# Altium schematic sheet Aux_Outputs.SchDoc: RP2040 CNC
size B; Author: AM; CompanyName: Expatria Technologies; DrawnBy: A.Marles; Engineer: AM; Organization: Expatria Technolgoies; DocumentNumber: 10; SheetNumber: 10; SheetTotal: 14
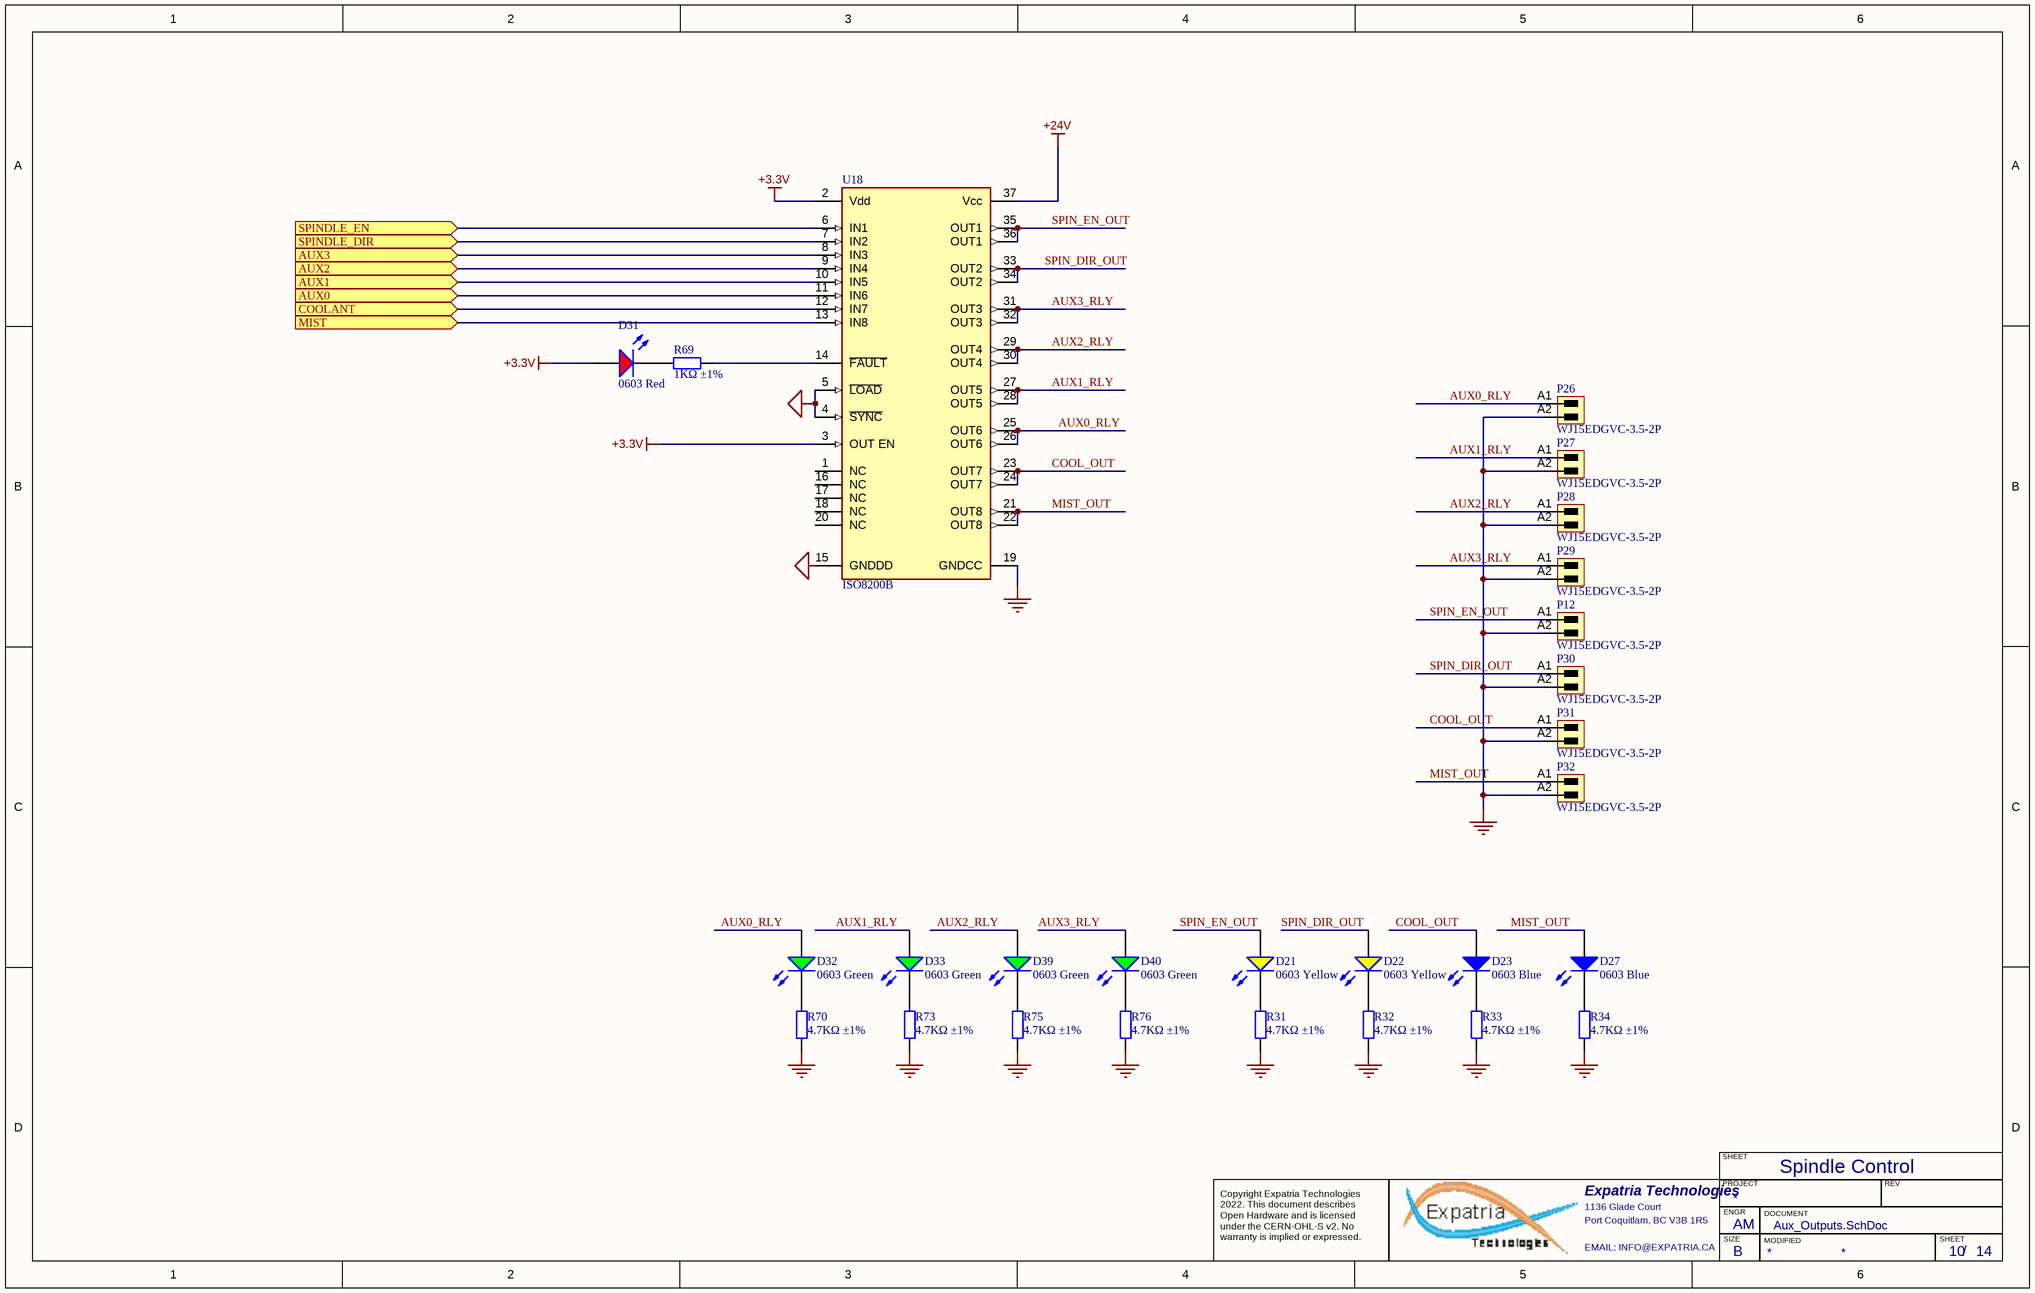
[diagram p0: Aux_Outputs.SchDoc]

## Parts
D21  0603 Yellow  [0603_LED_S1]
D22  0603 Yellow  [0603_LED_S1]
D23  0603 Blue  [0603_LED_S1]
D27  0603 Blue  [0603_LED_S1]
D31  0603 Red  [0603_LED_S1]
D32  0603 Green  [0603_LED_S1]
D33  0603 Green  [0603_LED_S1]
D39  0603 Green  [0603_LED_S1]
D40  0603 Green  [0603_LED_S1]
P12  WJ15EDGVC-3.5-2P  [691321100002]
P26  WJ15EDGVC-3.5-2P  [691321100002]
P27  WJ15EDGVC-3.5-2P  [691321100002]
P28  WJ15EDGVC-3.5-2P  [691321100002]
P29  WJ15EDGVC-3.5-2P  [691321100002]
P30  WJ15EDGVC-3.5-2P  [691321100002]
P31  WJ15EDGVC-3.5-2P  [691321100002]
P32  WJ15EDGVC-3.5-2P  [691321100002]
R31  4.7KΩ ±1%  [0402_R]
R32  4.7KΩ ±1%  [0402_R]
R33  4.7KΩ ±1%  [0402_R]
R34  4.7KΩ ±1%  [0402_R]
R69  1KΩ ±1%  [0402_R]
R70  4.7KΩ ±1%  [0402_R]
R73  4.7KΩ ±1%  [0402_R]
R75  4.7KΩ ±1%  [0402_R]
R76  4.7KΩ ±1%  [0402_R]
U18  ISO8200B  [FP-PowerSO-36-MFG]

## Ports
AUX0 (in), AUX1 (in), AUX2 (in), AUX3 (in), COOLANT (in), MIST (in), SPINDLE_DIR (in), SPINDLE_EN (in)

## Nets
+3.3V: D31.A U18.2(Vdd) U18.3(OUT_EN)
+24V: U18.37(Vcc)
GND: P12.A2 P26.A2 P27.A2 P28.A2 P29.A2 P30.A2 P31.A2 P32.A2 R31.1 R32.1 R33.1 R34.1 R70.1 R73.1 R75.1 R76.1 U18.19(GNDCC)
MCU_GND: U18.4(~{SYNC}) U18.5(~{LOAD}) U18.15(GNDDD)
AUX0: U18.11(IN6) ; port AUX0
AUX0_RLY: D32.A P26.A1 U18.25(OUT6) U18.26(OUT6)
AUX1: U18.10(IN5) ; port AUX1
AUX1_RLY: D33.A P27.A1 U18.27(OUT5) U18.28(OUT5)
AUX2: U18.9(IN4) ; port AUX2
AUX2_RLY: D39.A P28.A1 U18.29(OUT4) U18.30(OUT4)
AUX3: U18.8(IN3) ; port AUX3
AUX3_RLY: D40.A P29.A1 U18.31(OUT3) U18.32(OUT3)
COOL_OUT: D23.A P31.A1 U18.23(OUT7) U18.24(OUT7)
COOLANT: U18.12(IN7) ; port COOLANT
MIST: U18.13(IN8) ; port MIST
MIST_OUT: D27.A P32.A1 U18.21(OUT8) U18.22(OUT8)
SPIN_DIR_OUT: D22.A P30.A1 U18.33(OUT2) U18.34(OUT2)
SPIN_EN_OUT: D21.A P12.A1 U18.35(OUT1) U18.36(OUT1)
SPINDLE_DIR: U18.7(IN2) ; port SPINDLE_DIR
SPINDLE_EN: U18.6(IN1) ; port SPINDLE_EN
NetD21_K: D21.K R31.2
NetD22_K: D22.K R32.2
NetD23_K: D23.K R33.2
NetD27_K: D27.K R34.2
NetD31_K: D31.K R69.1
NetD32_K: D32.K R70.2
NetD33_K: D33.K R73.2
NetD39_K: D39.K R75.2
NetD40_K: D40.K R76.2
NetR69_2: R69.2 U18.14(~{FAULT})

Not connected (* = marked no-connect by the designer): U18 1(NC) 16(NC) 17(NC) 18(NC) 20(NC)

## Notes on the sheet
- Spindle Control
- SHEET
- Expatria Technologies
- 1136 Glade Court
- Port Coquitlam, BC V3B 1R5
- PROJECT
- SIZE
- ENGR
- MODIFIED
- DOCUMENT
- REV
- Copyright Expatria Technologies 2022. This document describes Open Hardware and is licensed under the CERN-OHL-S v2. No warranty is implied or expressed.
- EMAIL: INFO@EXPATRIA.CA
- B
- /

## Library data of the parts
D21 D22 = 0603 LED Yellow: LED; ComponentLink1Description: 供应商链接; ComponentLink1URL: http://www.szlcsc.com/product/details_73147.html; Package: 0603; Supplier: LC; SuppliersPartNumber: C72038; Color: Yellow
D23 D27 = 0603 LED Blue: LED; ComponentLink1Description: 供应商链接; ComponentLink1URL: http://www.szlcsc.com/product/details_73150.html; Package: 0603; Supplier: LC; SuppliersPartNumber: C965807; Color: Blue
D31 = 0603 LED Red: LED; ComponentLink1Description: 供应商链接; ComponentLink1URL: http://www.szlcsc.com/product/details_2659.html; Package: 0603; Supplier: LC; SuppliersPartNumber: C2286; Color: Red
D32 D33 D39 D40 = 0603 LED Green: LED; ComponentLink1Description: 供应商链接; ComponentLink1URL: http://www.szlcsc.com/product/details_73152.html; Package: 0603; Supplier: LC; SuppliersPartNumber: C72043; Color: Green
P12 P26-P32 = 3.5mm Terminal Header 2p: Header,Male Pin,Covered(4 Sided) 2 1 0.138"（3.50mm） 2 P=3.5mm Pluggable System Terminal Block RoHS; Manufacturer: Weidmueller; Manufacturer 1: Weidmuller; Manufacturer Part Number 1: 1604470000; UL_94_flammability_rating: V-0; Pitch_mm: 3.5 mm; Side_termination_characteristic: closed side; Pitch_inch: 0.138 inch; Solder_pin_length_mm: 3.2 mm; Short_text_for_material: SL 3.50/02/180G 3.2SN OR BX; ComponentLink1Description: Manufacturer URL; ComponentLink1URL: http://www.weidmueller.com/; PartNumber: WJ15EDGVC-3.5-2P; Revision: V1; PackageReference: SL_3_50_180G_02; Packaging: Box; SuppliersPartNumber: C192777
R31-R34 R70 R73 R75 R76 = 0402 4.7K (4701) 1%: Chip resistor; Manufacturer: Uniroyal Elec; PartNumber: 0402WGF4701TCE; Power: 1/16W; ComponentLink1Description: Supplier link; ComponentLink1URL: http://www.szlcsc.com/product/details_26643.html; Package: 0402; Supplier: LC; SuppliersPartNumber: C25900; Resistance: 4.7KΩ; Tolerance: 1%
R69 = 0402 1K (1001) 1%: Chip resistor; Manufacturer: Uniroyal Elec; PartNumber: 0402WGF1001TCE; Power: 1/16W; ComponentLink1Description: Supplier link; ComponentLink1URL: http://www.szlcsc.com/product/details_12256.html; Package: 0402; Supplier: LC; SuppliersPartNumber: C11702; Resistance: 1KΩ; Tolerance: 1%
U18 = CMP-12148-000008-1: IC PWR DRIVER 1:1 PWRSO36; Manufacturer: STMicroelectronics; Fall Time: 5us; Turn On Delay Time: 17us; Output Voltage: 10.5-36V; Max Supply Voltage: 6.5V; Max Junction Temp: +125°C; Output Current: 0.7A; Number Of Outputs: 8; Nominal Supply Current: 4.4-4.5mA; Min Supply Voltage: 3V; Standoff Height: 0.1mm; Turn Off Delay Time: 22us; Package: PowerSO-36; Device Class L1: Integrated Circuits (ICs); Temperature Range High: +125°C; Rise Time: 5us; Lead Free: Yes; Device Class L3: Gate Drivers; Temperature Range Low: -40°C; Manufacturer Part Number: ISO8200B; Height: 3.6mm; Automotive: No; RoHS: TRUE; ComponentLink2Description: Datasheet; Number Of Drivers: 8; Digikey Description: IC PWR DRIVER 1:1 PWRSO36; Temperature: -40°C to +125°C; Octopart: https://octopart.com/iso8200b-stmicroelectronics-30038077; Category: IC; Ipc Land Pattern Name: SOP65P1420X360-36; Mouser Description: Power Switch ICs - Power Distribution Galvanic 8-Ch SSR 0.11 Ohm .07A 45V; Device Class L2: Power Management ICs; ComponentLink2URL: http://www.st.com/content/ccc/resource/technical/document/datasheet/55/10/39/98/e1/07/44/a4/DM00068084.pdf/files/DM00068084.pdf/jcr:content/translations/en.DM00068084.pdf